# Altium schematic sheet 04-SPDIF_IIC.SchDoc
size A4; 学校: 辽宁工程技术大学; 考号: 2107010403; 证件号: 532124200305070711; 图号: 第1幅; 图号数: 总共7幅; SheetNumber: 4; SheetTotal: 6; 单位名称: 辽宁工程技术大学; 身份证号: 532124200305070711; 姓名: 邓祥涛; 图名: mydesign; 选手编号: 84011514
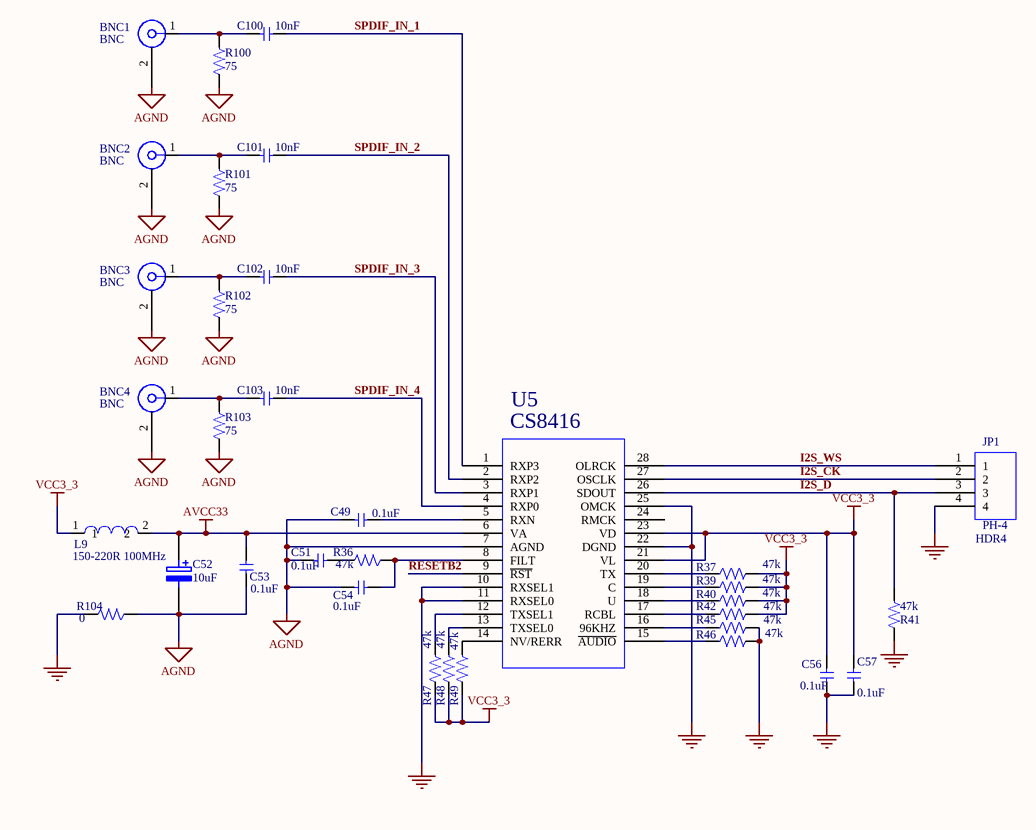
[diagram p0: 04-SPDIF_IIC.SchDoc]

## Parts
BNC1  BNC  [RCA-101]
BNC2  BNC  [RCA-101]
BNC3  BNC  [RCA-101]
BNC4  BNC  [RCA-101]
C49  value 0.1uF  [C0603]  (hidden comment: C_2)
C51  value 0.1uF  [C0603]  (hidden comment: C_2)
C52  10uF  [3528-C]
C53  value 0.1uF  [C0603]  (hidden comment: C_2)
C54  value 0.1uF  [C0603]  (hidden comment: C_2)
C56  value 0.1uF  [C0603]  (hidden comment: C_2)
C57  value 0.1uF  [C0603]  (hidden comment: C_2)
C100  value 10nF  [C0603]  (hidden comment: C_2)
C101  value 10nF  [C0603]  (hidden comment: C_2)
C102  value 10nF  [C0603]  (hidden comment: C_2)
C103  value 10nF  [C0603]  (hidden comment: C_2)
JP1  value PH-4  [HDR4]  (hidden comment: HEADER_4)
L9  value 150-220R 100MHz  [0805-l]  (hidden comment: INDUCTOR)
R36  value 47k  [R0603]  (hidden comment: R_3)
R37  value 47k  [R0603]  (hidden comment: R_3)
R39  value 47k  [R0603]  (hidden comment: R_3)
R40  value 47k  [R0603]  (hidden comment: R_3)
R41  value 47k  [R0603]  (hidden comment: R_3)
R42  value 47k  [R0603]  (hidden comment: R_3)
R45  value 47k  [R0603]  (hidden comment: R_3)
R46  value 47k  [R0603]  (hidden comment: R_3)
R47  value 47k  [R0603]  (hidden comment: R_3)
R48  value 47k  [R0603]  (hidden comment: R_3)
R49  value 47k  [R0603]  (hidden comment: R_3)
R100  value 75  [R0603]  (hidden comment: R_3)
R101  value 75  [R0603]  (hidden comment: R_3)
R102  value 75  [R0603]  (hidden comment: R_3)
R103  value 75  [R0603]  (hidden comment: R_3)
R104  value 0  [R0603]  (hidden comment: R_3)
U5  value CS8416  [TSSOP28]  (hidden comment: ADG794_1)

## Nets
AGND: BNC1.2(SHIELD) BNC2.2(SHIELD) BNC3.2(SHIELD) BNC4.2(SHIELD) C49.1 C51.1 C52.2 C53.1 C54.1 R100.2 R101.2 R102.2 R103.2 R104.1 U5.7(AGND)
AVCC33: C52.1 C53.2 L9.2 U5.6(VA)
GND: C56.1 C57.1 JP1.4 R41.2 R45.2 R46.2 R104.2 U5.10(RXSEL1) U5.11(RXSEL0) U5.22(DGND) U5.25(OMCK)
VCC3_3: C56.2 C57.2 L9.1 R37.2 R39.2 R40.2 R42.2 R47.2 R48.2 R49.2 U5.21(VL) U5.23(VD)
I2S_CK: JP1.2 U5.27(OSCLK)
I2S_D: JP1.3 R41.1 U5.26(SDOUT)
I2S_WS: JP1.1 U5.28(OLRCK)
RESETB2: U5.9(~{RST})
SPDIF_IN_1: C100.2 U5.1(RXP3)
SPDIF_IN_2: C101.2 U5.2(RXP2)
SPDIF_IN_3: C102.2 U5.3(RXP1)
SPDIF_IN_4: C103.2 U5.4(RXP0)
NetBNC1_1: BNC1.1(CENTER) C100.1 R100.1
NetBNC2_1: BNC2.1(CENTER) C101.1 R101.1
NetBNC3_1: BNC3.1(CENTER) C102.1 R102.1
NetBNC4_1: BNC4.1(CENTER) C103.1 R103.1
NetC49_2: C49.2 U5.5(RXN)
NetC51_2: C51.2 R36.2
NetC54_2: C54.2 R36.1 U5.8(FILT)
NetR37_1: R37.1 U5.20(TX)
NetR39_1: R39.1 U5.19(C)
NetR40_1: R40.1 U5.18(U)
NetR42_1: R42.1 U5.17(RCBL)
NetR45_1: R45.1 U5.16(96KHZ)
NetR46_1: R46.1 U5.15(~{AUDIO})
NetR47_1: R47.1 U5.12(TXSEL1)
NetR48_1: R48.1 U5.13(TXSEL0)
NetR49_1: R49.1 U5.14(NV/RERR)

Not connected (* = marked no-connect by the designer): U5 24(RMCK)

## Notes on the sheet
- 单位名称
- 选手信息
- 图名
- 文件名
- 当前日期
- 第
- 幅
- 当前时间
- 总共

## Library data of the parts
BNC1-BNC4 = BNC: SOURCE_PATH: C:\PROGRAM FILES\印院出品\CAPTURE 16.2\LIBRARY\CONNECTOR.OLB; PCB DECAL: RCA-101; VALUE: BNC
C49 C51 C53 C54 C56 C57 C100-C103 = C_2: PCB DECAL: 0603; SOURCE_PATH: C:\ORCAD\ORCAD_10.0\TOOLS\CAPTURE\LIBRARY\PSPICE\ANALOG.OLB; DIST: FLAT; PSPICETEMPLATE: C^@REFDES %1 %2 ?TOLERANCE|C^@REFDES| @VALUE ?IC/IC=@IC/ ?TOLERANCE|\n.model C^@REFDES CAP C=1 DEV=@TOLERANCE%|; VOLTAGE: CMAX; CURRENT: CIMAX; KNEE: CBMAX; SLOPE: CSMAX; MAX_TEMP: CTMAX
C52 = ELECTRO2: Electrolytic Capacitor
JP1 = HEADER_4: SOURCE_PATH: C:\PROGRAM FILES\ORCAD\CAPTURE\LIBRARY\CONNECTOR.OLB; PCB DECAL: HDR4
L9 = INDUCTOR: PCB DECAL: 0805; SOURCE_PATH: C:\ORCADWIN\CAPTURE\LIBRARY\PCBDEV.OLB
R36 R37 R39-R42 R45-R49 R100-R104 = R_3: PCB DECAL: 0603; SOURCE_PATH: C:\ORCAD\ORCAD_10.0\TOOLS\CAPTURE\LIBRARY\PSPICE\ANALOG.OLB; POWER: RMAX; MAX_TEMP: RTMAX; SLOPE: RSMAX; VOLTAGE: RVMAX; PSPICETEMPLATE: R^@REFDES %1 %2 ?TOLERANCE|R^@REFDES| @VALUE  ?TOLERANCE|\n.model R^@REFDES RES R=1 DEV=@TOLERANCE%|; DIST: FLAT
U5 = ADG794_1: SOURCE_PATH: C:\DOCUMENTS AND SETTINGS\YTIAN\DESKTOP\CH7026_APP\CT357_QFN_HDMI_APPLICATION_BOARD.DSN; PCB DECAL: TSSOP28